# Altium schematic sheet sonar_tx.SchDoc
size A4
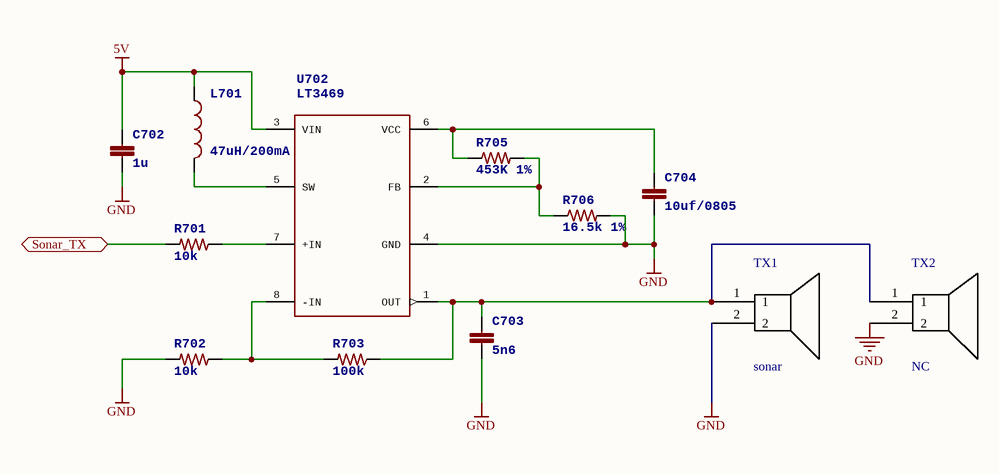
[diagram p0: sonar_tx.SchDoc]

## Parts
C702  1u  [0402]
C703  5n6  [0402]
C704  10uf/0805  [0805]
L701  47uH/200mA  [L3521]
R701  10k  [0402]
R702  10k  [0402]
R703  100k  [0402]
R705  453K 1%  [0402]
R706  16.5k 1%  [0402]
TX1  sonar  [sonar-16mm]
TX2  NC  [sonar-10mm]
U702  LT3469  [SOT23-8]

## Ports
Sonar_TX

## Nets
5V: C702.1 L701.1 U702.3(VIN)
GND: C702.2 C703.2 C704.2 R702.2 R706.2 TX1.2 TX2.2 U702.4(GND)
Sonar_TX: R701.2 ; port Sonar_TX
NetC703_1: C703.1 R703.1 TX1.1 TX2.1 U702.1(OUT)
NetC704_1: C704.1 R705.1 U702.6(VCC)
NetL701_2: L701.2 U702.5(SW)
NetR701_1: R701.1 U702.7(+IN)
NetR702_1: R702.1 R703.2 U702.8(-IN)
NetR705_2: R705.2 R706.1 U702.2(FB)

## Library data of the parts
C702 = CAP0603: <b>Capacitor</b> / Standard 0603 ceramic capacitor, and 0.1" leaded capacitor.; PARTNO: CC0603ZRY5V7BB105
C703 = CAP0402: <b>Capacitor</b> / Standard 0603 ceramic capacitor, and 0.1" leaded capacitor.; PARTNO: C0402C562K5RACTU
C704 = CAP0402: <b>Capacitor</b> / Standard 0603 ceramic capacitor, and 0.1" leaded capacitor.; PARTNO: C1005X5R1C474K050BC
L701 = INDUCTOR0805: <b>Inductors</b> / Basic Inductor/Choke - 0603 and 1210. Footprints are not proven and vary greatly between part numbers. / SRR1210: Bourns SRR1210 parts, e.g. SRR1210-100M; PARTNO: MLZ2012M470W
R701-R703 R705 R706 = RESISTOR0402-RES: <b>Resistor</b> / Basic schematic elements and footprints for 0603, 1206, and PTH 1/10th watt (small) resistors.; PARTNO: RMCF0402FT453K
TX2 = sonar
U702 = LT3469: LT3469 Piezo microactuator driver with boost regulator; PARTNO: LT3469ETS8